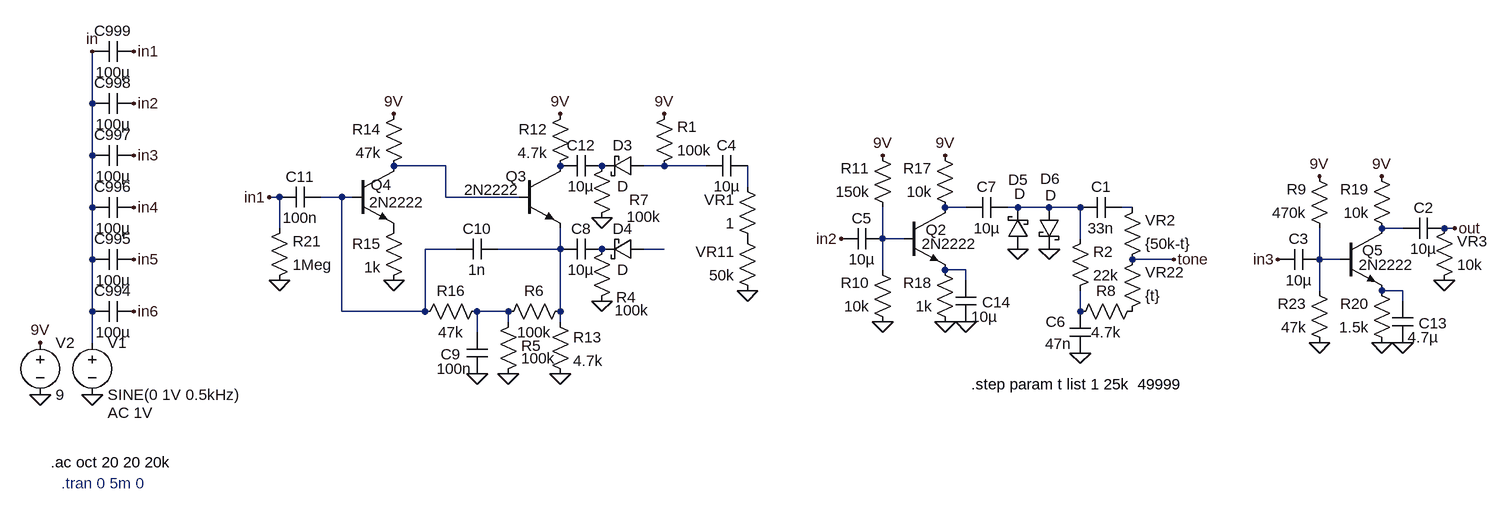
[diagram p0: schematic teisco_fuzz.asc]
teisco_fuzz.asc, the LTspice schematic file:
Version 4
SHEET 1 4260 4108
WIRE -3712 1456 -3712 1376
WIRE -3712 1536 -3712 1456
WIRE -3168 1552 -3248 1552
WIRE -2832 1552 -2864 1552
WIRE -2768 1552 -2832 1552
WIRE -2704 1584 -2704 1552
WIRE -3424 1600 -3440 1600
WIRE -3328 1600 -3360 1600
WIRE -3312 1600 -3328 1600
WIRE -3168 1600 -3168 1552
WIRE -3056 1600 -3168 1600
WIRE -3712 1616 -3712 1536
WIRE -2368 1616 -2400 1616
WIRE -2288 1616 -2304 1616
WIRE -2240 1616 -2288 1616
WIRE -2192 1616 -2240 1616
WIRE -2112 1616 -2128 1616
WIRE -3424 1648 -3424 1600
WIRE -1696 1648 -1728 1648
WIRE -1616 1648 -1632 1648
WIRE -2496 1664 -2496 1616
WIRE -2464 1664 -2496 1664
WIRE -2192 1664 -2192 1616
WIRE -3152 1680 -3200 1680
WIRE -2992 1680 -2992 1648
WIRE -2992 1680 -3088 1680
WIRE -2832 1680 -2864 1680
WIRE -3712 1696 -3712 1616
WIRE -2048 1696 -2112 1696
WIRE -1824 1696 -1824 1648
WIRE -1792 1696 -1824 1696
WIRE -2496 1712 -2496 1664
WIRE -2368 1712 -2400 1712
WIRE -2368 1728 -2368 1712
WIRE -1824 1744 -1824 1696
WIRE -1696 1744 -1728 1744
WIRE -1696 1760 -1696 1744
WIRE -3712 1776 -3712 1696
WIRE -3328 1776 -3328 1600
WIRE -3200 1776 -3200 1680
WIRE -3200 1776 -3328 1776
WIRE -3072 1776 -3120 1776
WIRE -2992 1776 -2992 1680
WIRE -2192 1776 -2192 1744
WIRE -3072 1792 -3072 1776
WIRE -2992 1792 -2992 1776
WIRE -3120 1808 -3120 1776
WIRE -3712 1824 -3712 1776
FLAG -3712 1904 0
FLAG -3712 1376 in
FLAG -3792 1904 0
FLAG -3792 1824 9V
FLAG -3648 1376 in1
FLAG -3648 1456 in2
FLAG -3648 1536 in3
FLAG -3648 1616 in4
FLAG -3648 1696 in5
FLAG -3648 1776 in6
FLAG -3440 1600 in1
FLAG -3248 1728 0
FLAG -3120 1872 0
FLAG -3072 1872 0
FLAG -2992 1872 0
FLAG -3248 1472 9V
FLAG -2992 1472 9V
FLAG -2928 1632 0
FLAG -2928 1760 0
FLAG -2832 1472 9V
FLAG -2704 1744 0
FLAG -2496 1792 0
FLAG -2400 1792 0
FLAG -2368 1792 0
FLAG -2496 1536 9V
FLAG -2400 1536 9V
FLAG -2288 1680 0
FLAG -2240 1680 0
FLAG -2192 1840 0
FLAG -1824 1824 0
FLAG -1728 1824 0
FLAG -1696 1824 0
FLAG -1824 1568 9V
FLAG -1728 1568 9V
FLAG -1632 1728 0
FLAG -3424 1728 0
FLAG -2560 1664 in2
FLAG -1888 1696 in3
FLAG -2048 1696 tone
FLAG -1616 1648 out
SYMBOL voltage -3712 1808 R0
WINDOW 123 24 124 Left 2
WINDOW 39 0 0 Left 2
SYMATTR Value2 AC 1V
SYMATTR InstName V1
SYMATTR Value SINE(0 1V 0.5kHz)
SYMBOL voltage -3792 1808 R0
WINDOW 123 0 0 Left 0
WINDOW 39 0 0 Left 0
SYMATTR InstName V2
SYMATTR Value 9
SYMBOL cap -3648 1440 R90
WINDOW 0 0 32 VBottom 2
WINDOW 3 32 32 VTop 2
SYMATTR InstName C998
SYMATTR Value 100µ
SYMBOL cap -3648 1520 R90
WINDOW 0 0 32 VBottom 2
WINDOW 3 32 32 VTop 2
SYMATTR InstName C997
SYMATTR Value 100µ
SYMBOL cap -3648 1600 R90
WINDOW 0 0 32 VBottom 2
WINDOW 3 32 32 VTop 2
SYMATTR InstName C996
SYMATTR Value 100µ
SYMBOL cap -3648 1360 R90
WINDOW 0 0 32 VBottom 2
WINDOW 3 32 32 VTop 2
SYMATTR InstName C999
SYMATTR Value 100µ
SYMBOL cap -3648 1680 R90
WINDOW 0 0 32 VBottom 2
WINDOW 3 32 32 VTop 2
SYMATTR InstName C995
SYMATTR Value 100µ
SYMBOL cap -3648 1760 R90
WINDOW 0 0 32 VBottom 2
WINDOW 3 32 32 VTop 2
SYMATTR InstName C994
SYMATTR Value 100µ
SYMBOL npn -3312 1552 R0
WINDOW 0 28 29 Left 2
WINDOW 3 26 56 Left 2
SYMATTR InstName Q4
SYMATTR Value 2N2222
SYMBOL cap -3360 1584 R90
WINDOW 0 0 32 VBottom 2
WINDOW 3 32 32 VTop 2
SYMATTR InstName C11
SYMATTR Value 100n
SYMBOL res -3232 1456 M0
SYMATTR InstName R14
SYMATTR Value 47k
SYMBOL npn -3056 1552 R0
WINDOW 0 -20 16 Left 2
WINDOW 3 -84 37 Left 2
SYMATTR InstName Q3
SYMATTR Value 2N2222
SYMBOL res -3232 1632 M0
SYMATTR InstName R15
SYMATTR Value 1k
SYMBOL cap -3088 1664 R90
WINDOW 0 0 32 VBottom 2
WINDOW 3 32 32 VTop 2
SYMATTR InstName C10
SYMATTR Value 1n
SYMBOL res -3104 1760 R90
WINDOW 0 0 56 VBottom 2
WINDOW 3 32 56 VTop 2
SYMATTR InstName R16
SYMATTR Value 47k
SYMBOL cap -3104 1872 R180
WINDOW 0 41 30 Left 2
WINDOW 3 24 8 Left 2
SYMATTR InstName C9
SYMATTR Value 100n
SYMBOL res -3088 1888 M180
WINDOW 0 36 59 Left 2
WINDOW 3 36 40 Left 2
SYMATTR InstName R5
SYMATTR Value 100k
SYMBOL res -2976 1760 R90
WINDOW 0 0 56 VBottom 2
WINDOW 3 32 56 VTop 2
SYMATTR InstName R6
SYMATTR Value 100k
SYMBOL res -3008 1776 R0
SYMATTR InstName R13
SYMATTR Value 4.7k
SYMBOL res -2976 1456 M0
SYMATTR InstName R12
SYMATTR Value 4.7k
SYMBOL cap -2928 1664 R90
WINDOW 0 0 32 VBottom 2
WINDOW 3 32 32 VTop 2
SYMATTR InstName C8
SYMATTR Value 10µ
SYMBOL cap -2928 1536 R90
WINDOW 0 0 32 VBottom 2
WINDOW 3 32 32 VTop 2
SYMATTR InstName C12
SYMATTR Value 10µ
SYMBOL res -2944 1648 M180
WINDOW 0 58 44 Left 2
WINDOW 3 54 18 Left 2
SYMATTR InstName R7
SYMATTR Value 100k
SYMBOL res -2944 1776 M180
WINDOW 0 38 22 Left 2
WINDOW 3 36 2 Left 2
SYMATTR InstName R4
SYMATTR Value 100k
SYMBOL res -2848 1568 M180
WINDOW 0 36 76 Left 2
WINDOW 3 36 40 Left 2
SYMATTR InstName R1
SYMATTR Value 100k
SYMBOL cap -2704 1536 R90
WINDOW 0 0 32 VBottom 2
WINDOW 3 32 32 VTop 2
SYMATTR InstName C4
SYMATTR Value 10µ
SYMBOL res -2688 1680 R180
WINDOW 0 36 76 Left 2
WINDOW 3 36 40 Left 2
SYMATTR InstName VR1
SYMATTR Value 1
SYMBOL res -2688 1760 R180
WINDOW 0 36 76 Left 2
WINDOW 3 36 40 Left 2
SYMATTR InstName VR11
SYMATTR Value 50k
SYMBOL cap -2496 1648 R90
WINDOW 0 0 32 VBottom 2
WINDOW 3 32 32 VTop 2
SYMATTR InstName C5
SYMATTR Value 10µ
SYMBOL res -2480 1632 R180
WINDOW 0 36 76 Left 2
WINDOW 3 36 40 Left 2
SYMATTR InstName R11
SYMATTR Value 150k
SYMBOL res -2480 1808 R180
WINDOW 0 36 76 Left 2
WINDOW 3 36 40 Left 2
SYMATTR InstName R10
SYMATTR Value 10k
SYMBOL npn -2464 1616 R0
WINDOW 0 34 34 Left 2
WINDOW 3 28 56 Left 2
SYMATTR InstName Q2
SYMATTR Value 2N2222
SYMBOL res -2384 1632 R180
WINDOW 0 36 76 Left 2
WINDOW 3 36 40 Left 2
SYMATTR InstName R17
SYMATTR Value 10k
SYMBOL res -2384 1808 R180
WINDOW 0 36 76 Left 2
WINDOW 3 36 40 Left 2
SYMATTR InstName R18
SYMATTR Value 1k
SYMBOL cap -2384 1792 M180
WINDOW 0 41 30 Left 2
WINDOW 3 24 8 Left 2
SYMATTR InstName C14
SYMATTR Value 10µ
SYMBOL cap -2304 1600 R90
WINDOW 0 0 32 VBottom 2
WINDOW 3 32 32 VTop 2
SYMATTR InstName C7
SYMATTR Value 10µ
SYMBOL cap -2128 1600 R90
WINDOW 0 0 32 VBottom 2
WINDOW 3 32 32 VTop 2
SYMATTR InstName C1
SYMATTR Value 33n
SYMBOL res -2208 1760 M180
WINDOW 0 36 76 Left 2
WINDOW 3 36 40 Left 2
SYMATTR InstName R2
SYMATTR Value 22k
SYMBOL cap -2208 1840 M180
WINDOW 0 -37 48 Left 2
WINDOW 3 -38 14 Left 2
SYMATTR InstName C6
SYMATTR Value 47n
SYMBOL res -2096 1760 R90
WINDOW 0 0 56 VBottom 2
WINDOW 3 32 56 VTop 2
SYMATTR InstName R8
SYMATTR Value 4.7k
SYMBOL res -2128 1712 M180
WINDOW 0 36 76 Left 2
WINDOW 3 36 40 Left 2
SYMATTR InstName VR2
SYMATTR Value {50k-t}
SYMBOL res -2128 1792 M180
WINDOW 0 36 76 Left 2
WINDOW 3 36 40 Left 2
SYMATTR InstName VR22
SYMATTR Value {t}
SYMBOL cap -1824 1680 R90
WINDOW 0 0 32 VBottom 2
WINDOW 3 32 32 VTop 2
SYMATTR InstName C3
SYMATTR Value 10µ
SYMBOL res -1808 1664 R180
WINDOW 0 36 76 Left 2
WINDOW 3 36 40 Left 2
SYMATTR InstName R9
SYMATTR Value 470k
SYMBOL res -1808 1840 R180
WINDOW 0 36 76 Left 2
WINDOW 3 36 40 Left 2
SYMATTR InstName R23
SYMATTR Value 47k
SYMBOL npn -1792 1648 R0
WINDOW 0 34 34 Left 2
WINDOW 3 28 56 Left 2
SYMATTR InstName Q5
SYMATTR Value 2N2222
SYMBOL res -1712 1664 R180
WINDOW 0 36 76 Left 2
WINDOW 3 36 40 Left 2
SYMATTR InstName R19
SYMATTR Value 10k
SYMBOL res -1712 1840 R180
WINDOW 0 36 76 Left 2
WINDOW 3 36 40 Left 2
SYMATTR InstName R20
SYMATTR Value 1.5k
SYMBOL cap -1712 1824 M180
WINDOW 0 41 30 Left 2
WINDOW 3 24 8 Left 2
SYMATTR InstName C13
SYMATTR Value 4.7µ
SYMBOL cap -1632 1632 R90
WINDOW 0 0 32 VBottom 2
WINDOW 3 32 32 VTop 2
SYMATTR InstName C2
SYMATTR Value 10µ
SYMBOL res -1648 1744 M180
WINDOW 0 36 76 Left 2
WINDOW 3 36 40 Left 2
SYMATTR InstName VR3
SYMATTR Value 10k
SYMBOL res -3440 1744 M180
WINDOW 0 36 76 Left 2
WINDOW 3 36 40 Left 2
SYMATTR InstName R21
SYMATTR Value 1Meg
SYMBOL schottky -2864 1536 R90
WINDOW 0 0 32 VBottom 2
WINDOW 3 32 32 VTop 2
SYMATTR InstName D3
SYMBOL schottky -2864 1664 R90
WINDOW 0 0 32 VBottom 2
WINDOW 3 32 32 VTop 2
SYMATTR InstName D4
SYMBOL schottky -2272 1680 R180
WINDOW 0 0 107 Left 2
WINDOW 3 4 85 Left 2
SYMATTR InstName D5
SYMBOL schottky -2256 1616 R0
WINDOW 0 2 -44 Left 2
WINDOW 3 10 -19 Left 2
SYMATTR InstName D6
TEXT -3776 2008 Left 2 !.ac oct 20 20 20k
TEXT -3760 2040 Left 2 ;.tran 0 5m 0
TEXT -2360 1888 Left 2 !.step param t list 1 25k  49999

The netlist it stands for:
* teisco_fuzz.asc
V1 in 0 SINE(0 1V 0.5kHz) AC 1V
V2 9V 0 9
C998 in2 in 100µ
C997 in3 in 100µ
C996 in4 in 100µ
C999 in1 in 100µ
C995 in5 in 100µ
C994 in6 in 100µ
Q4 N001 N004 P001 0 2N2222
C11 N004 in1 100n
R14 9V N001 47k
Q3 P002 N001 N010 0 2N2222
R15 P001 0 1k
C10 N010 N004 1n
R16 N015 N004 47k
C9 0 N015 100n
R5 0 N015 100k
R6 N010 N015 100k
R13 N010 0 4.7k
R12 9V P002 4.7k
C8 P003 N010 10µ
C12 P004 P002 10µ
R7 0 P004 100k
R4 0 P003 100k
R1 N002 9V 100k
C4 N003 N002 10µ
R§VR1 P005 N003 1
R§VR11 0 P005 50k
C5 N009 in2 10µ
R11 N009 9V 150k
R10 0 N009 10k
Q2 N005 N009 N013 0 2N2222
R17 N005 9V 10k
R18 0 N013 1k
C14 0 N013 10µ
C7 N006 N005 10µ
C1 N007 N006 33n
R2 N016 N006 22k
C6 0 N016 47n
R8 P006 N016 4.7k
R§VR2 tone N007 {50k-t}
R§VR22 P006 tone {t}
C3 N012 in3 10µ
R9 N012 9V 470k
R23 0 N012 47k
Q5 N008 N012 N014 0 2N2222
R19 N008 9V 10k
R20 0 N014 1.5k
C13 0 N014 4.7µ
C2 out N008 10µ
R§VR3 0 out 10k
R21 0 in1 1Meg
D3 N002 P004 D
D4 N011 P003 D
D5 0 N006 D
D6 N006 0 D
.model D D
.lib standard.dio
.model NPN NPN
.model PNP PNP
.lib standard.bjt
.ac oct 20 20 20k
* .tran 0 5m 0
.step param t list 1 25k  49999
.backanno
.end